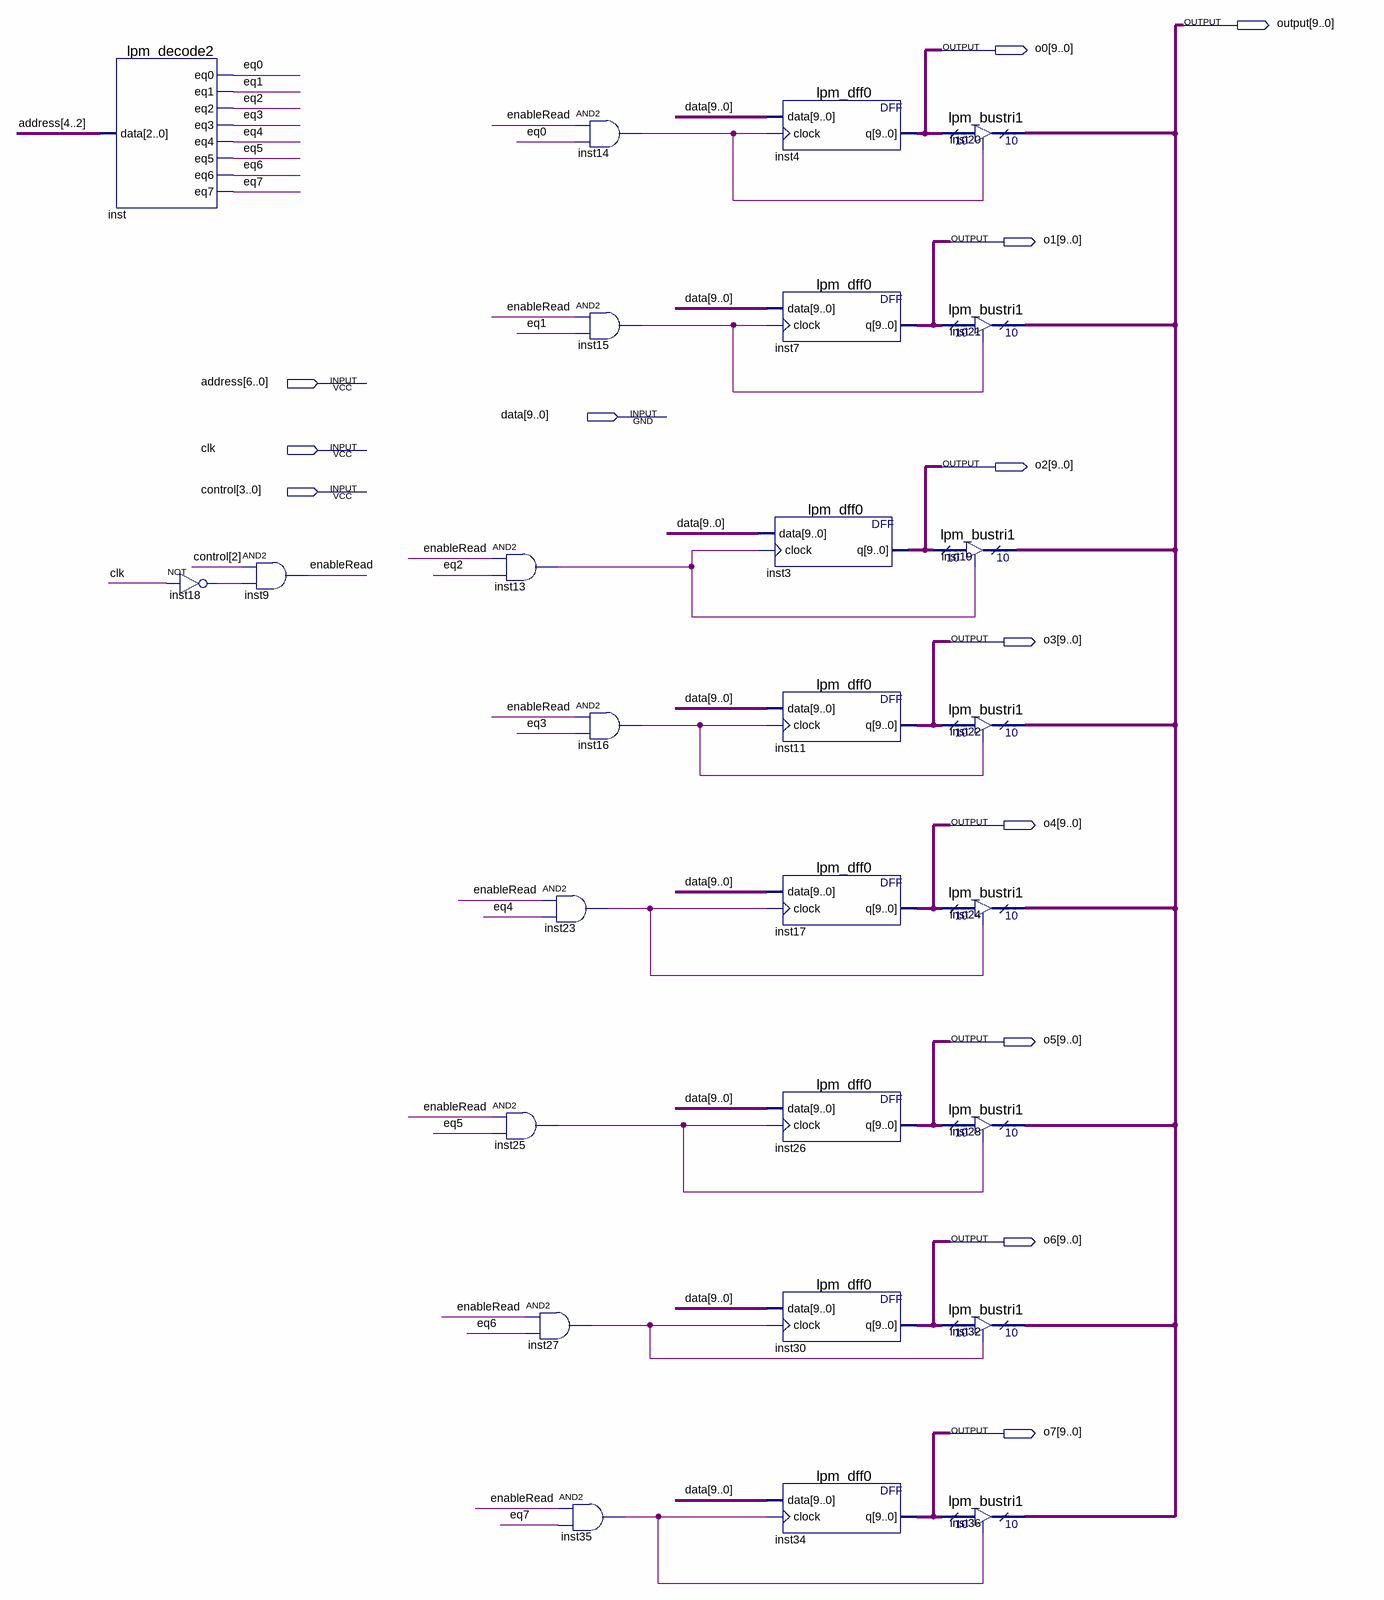
[diagram p0: schematic sheet]
// Quartus schematic POH.bdf as structural Verilog: 27 symbols, 13 pins
module POH (
  input  [6:0] address,
  input  [9:0] data,
  input  clk,
  input  [3:0] control,
  output [9:0] \output ,
  output [9:0] o0,
  output [9:0] o1,
  output [9:0] o2,
  output [9:0] o3,
  output [9:0] o4,
  output [9:0] o5,
  output [9:0] o6,
  output [9:0] o7
);

  wire enableRead, eq0, eq1, eq2, eq3, eq4, eq5, eq6, eq7, inst13_out, inst14_out, inst15_out, inst16_out,
       inst18_out, inst23_out, inst25_out, inst27_out, inst35_out;

  lpm_decode2 inst (
    .data(address[4:2]), .eq0(eq0), .eq1(eq1), .eq2(eq2), .eq3(eq3), .eq4(eq4), .eq5(eq5), .eq6(eq6),
    .eq7(eq7));
  not inst18 (inst18_out, clk);
  and inst9 (enableRead, control[2], inst18_out);
  and inst13 (inst13_out, enableRead, eq2);
  and inst23 (inst23_out, enableRead, eq4);
  and inst25 (inst25_out, enableRead, eq5);
  and inst27 (inst27_out, enableRead, eq6);
  and inst14 (inst14_out, enableRead, eq0);
  and inst15 (inst15_out, enableRead, eq1);
  and inst16 (inst16_out, enableRead, eq3);
  and inst35 (inst35_out, enableRead, eq7);
  lpm_dff0 inst4 (.data(data), .clock(inst14_out), .q(o0));
  lpm_dff0 inst7 (.data(data), .clock(inst15_out), .q(o1));
  lpm_dff0 inst3 (.data(data), .clock(inst13_out), .q(o2));
  lpm_dff0 inst11 (.data(data), .clock(inst16_out), .q(o3));
  lpm_dff0 inst17 (.data(data), .clock(inst23_out), .q(o4));
  lpm_dff0 inst26 (.data(data), .clock(inst25_out), .q(o5));
  lpm_dff0 inst30 (.data(data), .clock(inst27_out), .q(o6));
  lpm_dff0 inst34 (.data(data), .clock(inst35_out), .q(o7));
  lpm_bustri1 inst20 (.enabledt(inst14_out), .data(o0), .tridata(\output ));
  lpm_bustri1 inst21 (.enabledt(inst15_out), .data(o1), .tridata(\output ));
  lpm_bustri1 inst19 (.enabledt(inst13_out), .data(o2), .tridata(\output ));
  lpm_bustri1 inst22 (.enabledt(inst16_out), .data(o3), .tridata(\output ));
  lpm_bustri1 inst24 (.enabledt(inst23_out), .data(o4), .tridata(\output ));
  lpm_bustri1 inst28 (.enabledt(inst25_out), .data(o5), .tridata(\output ));
  lpm_bustri1 inst32 (.enabledt(inst27_out), .data(o6), .tridata(\output ));
  lpm_bustri1 inst36 (.enabledt(inst35_out), .data(o7), .tridata(\output ));
endmodule
